# Altium schematic sheet DistanceSensorBottom.SchDoc
size A
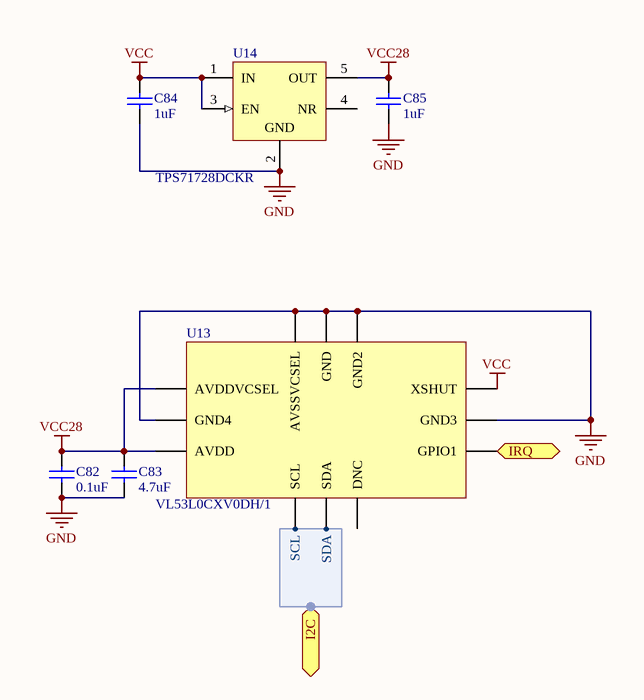
[diagram p0: DistanceSensorBottom.SchDoc]

## Parts
C82  value 0.1uF  [C0402[1005X55]]  (hidden comment: 0.1uF 6.3V 0402)
C83  value 4.7uF  [C0402[1005X55]]  (hidden comment: 4.7uF 6.3V 0402)
C84  value 1uF  [C0402[1005X55]]  (hidden comment: 1uF 6.3V 0402)
C85  value 1uF  [C0402[1005X55]]  (hidden comment: 1uF 6.3V 0402)
U13  VL53L0CXV0DH/1  [LGA-12]
U14  TPS71728DCKR  [DCK0005A_M]

## Ports
I2C (harness I2C), IRQ (out)

## Harnesses
I2C: SCL, SDA

## Nets
GND: C82.1 C83.1 C84.1 C85.1 U13.2(AVSSVCSEL) U13.3(GND) U13.4(GND2) U13.6(GND3) U13.12(GND4) U14.2(GND)
VCC: C84.2 U13.5(XSHUT) U14.1(IN) U14.3(EN)
VCC28: C82.2 C83.2 C85.2 U13.1(AVDDVCSEL) U13.11(AVDD) U14.5(OUT)
IRQ: U13.7(GPIO1) ; port IRQ
NetU13_9: U13.9(SDA) ; port I2C.SDA
NetU13_10: U13.10(SCL) ; port I2C.SCL

Not connected (* = marked no-connect by the designer): U13 8(DNC); U14 4(NR)

## Library data of the parts
C82 = CAP_0.1uF_6.3V_0402_10%: 0.1uF 6.3V 10% 0402 (1005 Metric); PartNumber: GRM155R70J104KA01D; Manufacturer: Murata; Mounting Technology: Surface Mount; PackageReference: 0402; PackageDescription: 0402 (1005 Metric); Voltage: 6.3V; Tolerance: 10%
C83 = CAP_4.7uF_6.3V_0402_20%: 4.7uF 6.3V 20% 0402 (1005 Metric); PartNumber: GRM155R60J475ME47D; Manufacturer: Murata; Mounting Technology: Surface Mount; PackageReference: 0402; PackageDescription: 0402 (1005 Metric); Voltage: 6.3V; Tolerance: 20%
C84 C85 = CAP_1uF_6.3V_0402_10%: 1uF 6.3V 10% 0402 (1005 Metric); PartNumber: GRM155R70J105KA12D; Manufacturer: Murata; Mounting Technology: Surface Mount; PackageReference: 0402; PackageDescription: 0402 (1005 Metric); Voltage: 6.3V; Tolerance: 10%
U13 = VL53L0CXV0DH/1: Optical Sensor Modules Time-of-Flight (ToF) ranging sensor; Manufacturer: STMicroelectronics; PartNumber: VL53L0CXV0DH/1; Mounting Technology: Surface Mount; PackageReference: LGA-12
U14 = CMP-0394-00823-2: Single Output High PSRR LDO, 150 mA, Fixed 2.8 V Output, 2.5 to 6.5 V Input, with Low IQ, 5-pin SC70 (DCK), -40 to 85 degC, Green (RoHS & no Sb/Br); Manufacturer: Texas Instruments; Vout Adj(Max)(V): 2.8; Accuracy(%): 3; Iout(Max)(A): 0.15; SubFamily: Single Channel LDO; Vdo(Typ)(mV): 170; Vin(Max)(V): 6.5; Vin(Min)(V): 2.5; Iq(Typ)(mA): 0.05; PackageVersion: 4093553-3/G; PartNumber: TPS71728DCKR; Fixed Output Options(V): 2.8; ComponentLink3Description: Package Specification; ComponentLink1URL: http://www.ti.com/; ComponentLink2Description: Datasheet; PackageReference: DCK0005A; DatasheetVersion: SBVS068G; PackageDescription: 5-Pin Plastic Small-Outline, Body 2 x 1.25 mm, Pitch 0.65 mm; ComponentLink1Description: Manufacturer URL; ComponentLink3URL: http://www.ti.com/litv/pdf/mpds025f; Mounting Technology: Surface Mount; ComponentLink2URL: http://www.ti.com/general/docs/lit/getliterature.tsp?genericPartNumber=TPS71728&fileType=pdf; Code_JEDEC: MO-203; Vout Adj(Min)(V): 2.8; Eco-Plan: Green (RoHS & no Sb/Br)